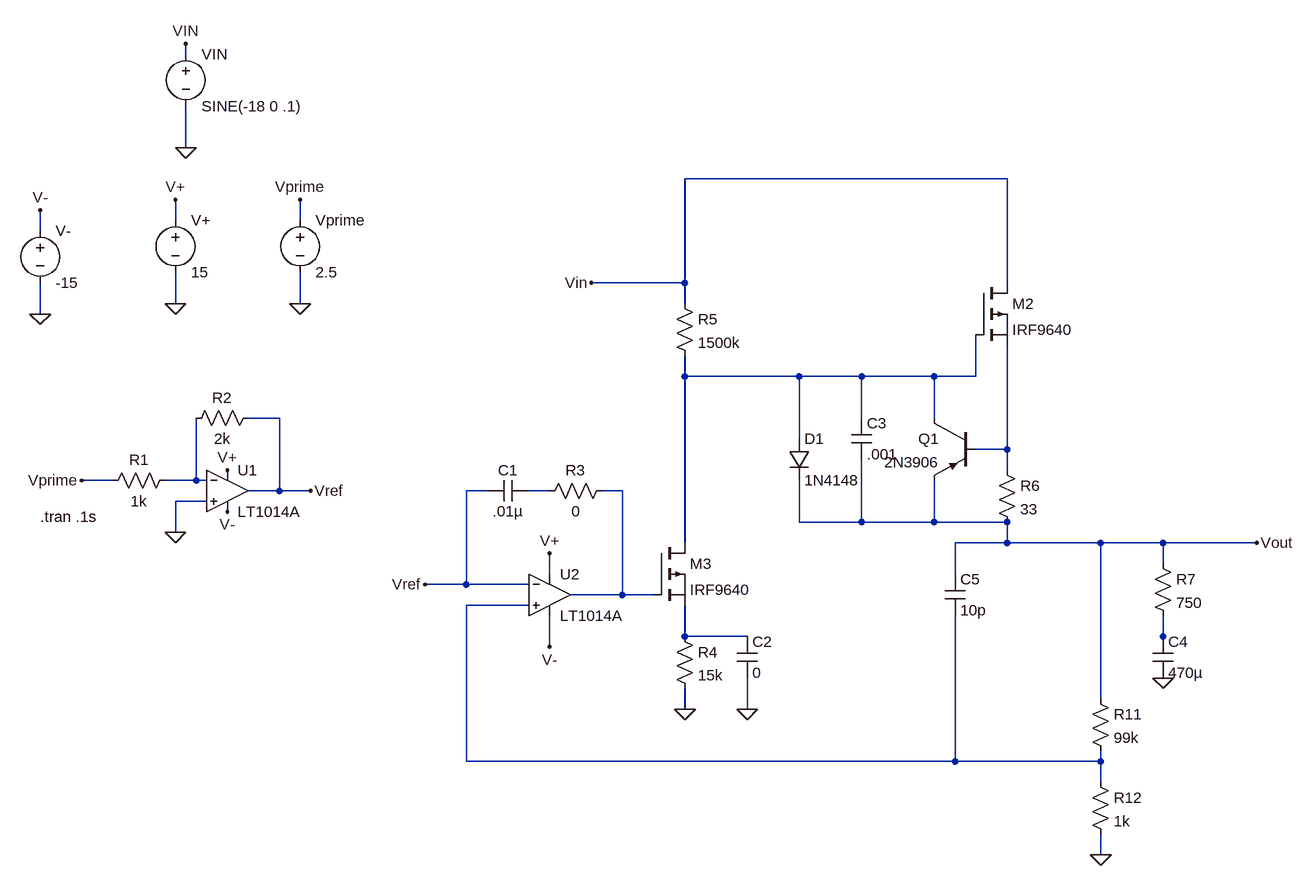
[diagram p0: schematic vregn.asc]
vregn.asc, the LTspice schematic file:
Version 4
SHEET 1 1328 1284
WIRE -448 32 -448 16
WIRE -448 176 -448 112
WIRE 816 224 320 224
WIRE -464 288 -464 256
WIRE -272 288 -272 256
WIRE -672 304 -672 272
WIRE 320 384 320 224
WIRE 320 384 176 384
WIRE 816 384 816 224
WIRE -464 416 -464 368
WIRE -272 416 -272 368
WIRE 320 416 320 384
WIRE -672 432 -672 384
WIRE 320 528 320 496
WIRE 496 528 320 528
WIRE 592 528 496 528
WIRE 704 528 592 528
WIRE 768 528 768 464
WIRE 768 528 704 528
WIRE -304 592 -352 592
WIRE 592 592 592 528
WIRE 704 592 704 528
WIRE 496 624 496 528
WIRE 816 640 816 480
WIRE 816 640 768 640
WIRE 816 672 816 640
WIRE -560 688 -608 688
WIRE -432 688 -432 592
WIRE -432 688 -480 688
WIRE -416 688 -432 688
WIRE -304 704 -304 592
WIRE -304 704 -352 704
WIRE -256 704 -304 704
WIRE 16 704 -16 704
WIRE 112 704 80 704
WIRE 224 704 192 704
WIRE -416 720 -464 720
WIRE 496 752 496 688
WIRE 592 752 592 656
WIRE 592 752 496 752
WIRE 704 752 704 688
WIRE 704 752 592 752
WIRE 816 752 704 752
WIRE -464 768 -464 720
WIRE 320 784 320 528
WIRE 816 784 816 752
WIRE 816 784 736 784
WIRE 960 784 816 784
WIRE 1056 784 960 784
WIRE 1200 784 1056 784
WIRE 1056 816 1056 784
WIRE 112 832 112 800
WIRE 736 832 736 784
WIRE -16 848 -16 704
WIRE -16 848 -80 848
WIRE 80 848 -16 848
WIRE 224 864 224 704
WIRE 224 864 144 864
WIRE 272 864 224 864
WIRE 80 880 -16 880
WIRE 320 928 320 880
WIRE 416 928 320 928
WIRE 1056 928 1056 896
WIRE 112 944 112 896
WIRE 1056 944 1056 928
WIRE 960 1024 960 784
WIRE 320 1040 320 1008
WIRE 416 1040 416 992
WIRE -16 1120 -16 880
WIRE 736 1120 736 896
WIRE 736 1120 -16 1120
WIRE 960 1120 960 1104
WIRE 960 1120 736 1120
WIRE 960 1152 960 1120
WIRE 960 1264 960 1232
FLAG -464 416 0
FLAG -464 256 V+
FLAG -272 256 Vprime
FLAG -272 416 0
FLAG -448 176 0
FLAG -672 432 0
FLAG -672 272 V-
FLAG 960 1264 0
FLAG 1056 992 0
FLAG 416 1040 0
FLAG 320 1040 0
FLAG 112 800 V+
FLAG -80 848 Vref
FLAG 176 384 Vin
FLAG 1200 784 Vout
FLAG -448 16 VIN
FLAG 112 944 V-
FLAG -608 688 Vprime
FLAG -256 704 Vref
FLAG -464 768 0
FLAG -384 672 V+
FLAG -384 736 V-
SYMBOL voltage -448 16 R0
WINDOW 123 0 0 Left 2
WINDOW 39 0 0 Left 2
SYMATTR InstName VIN
SYMATTR Value SINE(-18 0 .1)
SYMBOL voltage -464 272 R0
WINDOW 123 0 0 Left 2
WINDOW 39 0 0 Left 2
SYMATTR InstName V+
SYMATTR Value 15
SYMBOL voltage -272 272 R0
WINDOW 123 0 0 Left 2
WINDOW 39 0 0 Left 2
SYMATTR InstName Vprime
SYMATTR Value 2.5
SYMBOL voltage -672 288 R0
WINDOW 123 0 0 Left 2
WINDOW 39 0 0 Left 2
SYMATTR InstName V-
SYMATTR Value -15
SYMBOL Opamps\\LT1014A 112 800 R0
SYMATTR InstName U2
SYMBOL cap 80 688 R90
WINDOW 0 0 32 VBottom 2
WINDOW 3 32 32 VTop 2
SYMATTR InstName C1
SYMATTR Value .01µ
SYMBOL res 208 688 R90
WINDOW 0 0 56 VBottom 2
WINDOW 3 32 56 VTop 2
SYMATTR InstName R3
SYMATTR Value 0
SYMBOL res 304 912 R0
SYMATTR InstName R4
SYMATTR Value 15k
SYMBOL cap 400 928 R0
SYMATTR InstName C2
SYMATTR Value 0
SYMBOL diode 480 624 R0
SYMATTR InstName D1
SYMATTR Value 1N4148
SYMBOL cap 576 592 R0
SYMATTR InstName C3
SYMATTR Value .001
SYMBOL res 304 400 R0
SYMATTR InstName R5
SYMATTR Value 1500k
SYMBOL res 800 656 R0
SYMATTR InstName R6
SYMATTR Value 33
SYMBOL res 1040 800 R0
SYMATTR InstName R7
SYMATTR Value 750
SYMBOL cap 1040 928 R0
SYMATTR InstName C4
SYMATTR Value 470µ
SYMBOL cap 720 832 R0
SYMATTR InstName C5
SYMATTR Value 10p
SYMBOL res 944 1008 R0
SYMATTR InstName R11
SYMATTR Value 99k
SYMBOL res 944 1136 R0
SYMATTR InstName R12
SYMATTR Value 1k
SYMBOL pmos 768 384 R0
SYMATTR InstName M2
SYMATTR Value IRF9640
SYMBOL pnp 768 592 M0
SYMATTR InstName Q1
SYMATTR Value 2N3906
SYMBOL pmos 272 784 R0
SYMATTR InstName M3
SYMATTR Value IRF9640
SYMBOL Opamps\\LT1014A -384 640 R0
SYMATTR InstName U1
SYMBOL res -464 672 R90
WINDOW 0 0 56 VBottom 2
WINDOW 3 32 56 VTop 2
SYMATTR InstName R1
SYMATTR Value 1k
SYMBOL res -336 576 R90
WINDOW 0 0 56 VBottom 2
WINDOW 3 32 56 VTop 2
SYMATTR InstName R2
SYMATTR Value 2k
TEXT -672 744 Left 2 !.tran .1s

The netlist it stands for:
* vregn.asc
VIN Vin 0 SINE(-18 0 .1)
V+ V+ 0 15
Vprime Vprime 0 2.5
V- V- 0 -15
XU2 N006 Vref V+ V- N005 LT1014A  ; pins In+ In- V+ V- OUT
C1 N004 Vref .01µ
R3 N005 N004 0
R4 N007 0 15k
C2 N007 0 0
D1 N001 Vout 1N4148
C3 N001 Vout .001
R5 Vin N001 1500k
R6 N002 Vout 33
R7 Vout N008 750
C4 N008 0 470µ
C5 Vout N006 10p
R11 Vout N006 99k
R12 N006 0 1k
M2 Vin N001 N002 N002 IRF9640
Q1 N001 N002 Vout 0 2N3906
M3 N001 N005 N007 N007 IRF9640
XU1 0 N003 V+ V- Vref LT1014A  ; pins In+ In- V+ V- OUT
R1 N003 Vprime 1k
R2 Vref N003 2k
.model D D
.lib standard.dio
.model NPN NPN
.model PNP PNP
.lib standard.bjt
.model NMOS NMOS
.model PMOS PMOS
.lib standard.mos
.tran .1s
.backanno
.end